# Altium schematic sheet ESQUEMÁTICOS.SchDoc
size A4
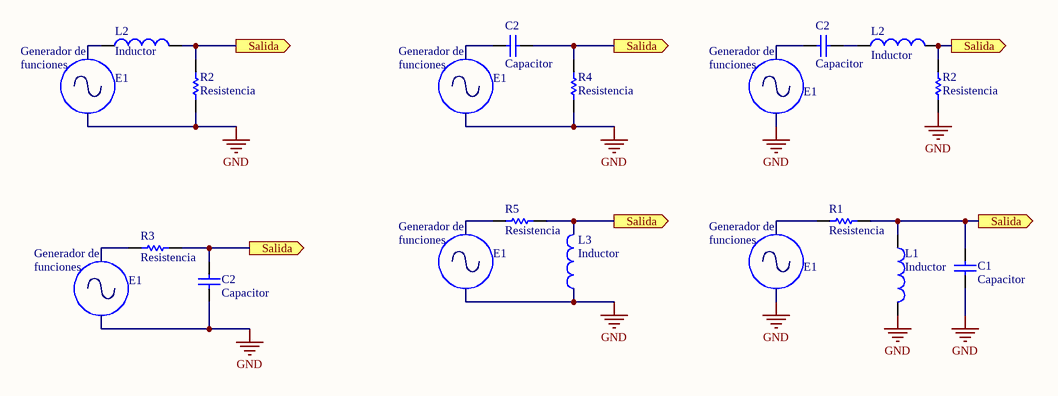
[diagram p0: ESQUEMÁTICOS.SchDoc]

## Parts
(Parts that share a designator on the sheet are numbered #1, #2 ... from top to bottom, then left to right.)
C1  Capacitor  [RAD-0.3]
C2#1  Capacitor  [RAD-0.3]
C2#2  Capacitor  [RAD-0.3]
C2#3  Capacitor  [RAD-0.3]
L1  Inductor  [0402-A]
L2#1  Inductor  [0402-A]
L2#2  Inductor  [0402-A]
L3  Inductor  [0402-A]
R1  Resistencia  [AXIAL-0.3]
R2#1  Resistencia  [AXIAL-0.3]
R2#2  Resistencia  [AXIAL-0.3]
R3  Resistencia  [AXIAL-0.3]
R4  Resistencia  [AXIAL-0.3]
R5  Resistencia  [AXIAL-0.3]

## Ports
Salida (out)

## Nets
GND: C1.2 C2#3.1 L1.2 L3.1 R2#1.1 R2#2.1 R4.1
Salida: C1.1 C2#1.1 C2#3.2 L1.1 L2#1.2 L2#2.2 L3.2 R1.1 R2#1.2 R2#2.2 R3.1 R4.2 R5.1 ; port Salida
NetC2#2_1: C2#2.1 L2#2.1

Not connected (* = marked no-connect by the designer): C2#1 2; C2#2 2; L2#1 1; R1 2; R3 2; R5 2

## Notes on the sheet
- (near L2#1) Generador de
- (near L2#1) funciones
- (near L2#1) E1
- (near C2#1) Generador de
- funciones
- (near C2#1) E1
- (near C2#2) Generador de
- (near C2#2) E1
- (near R3) Generador de
- (near R3) E1
- (near R5) Generador de
- (near R5) E1
- (near R1) Generador de
- (near R1) E1

## Library data of the parts
C1 C2#1-C2#3 = Cap: Published: 8-Jun-2000; LatestRevisionDate: 17-Jul-2002; LatestRevisionNote: Re-released for DXP Platform.; PackageReference: RAD-0.3; Publisher: Altium Limited; PackageDescription: Radial Cap, Thru-Hole; 2 Leads; 0.3 in Pin Spacing
L1 L2#1 L2#2 L3 = Inductor: Code_IEC: 1005; Published: 8-Jun-2000; LatestRevisionDate: 29-May-2009; LatestRevisionNote: IPC-7351 Footprint Added.; PackageReference: 0402-A; Publisher: Altium Limited; PackageDescription: Chip Inductor; Code_JEITA: 0402
R1 R2#1 R2#2 R3-R5 = Res1: Resistor; Published: 8-Jun-2000; LatestRevisionDate: 17-Jul-2002; LatestRevisionNote: Re-released for DXP Platform.; PackageReference: AXIAL-0.3; Publisher: Altium Limited; PackageDescription: Axial Device, Thru-Hole; 2 Leads; 0.3 in Pin Spacing